# EAGLE design 5V_DCDC_XL7035 (EAGLE 9.6.1)
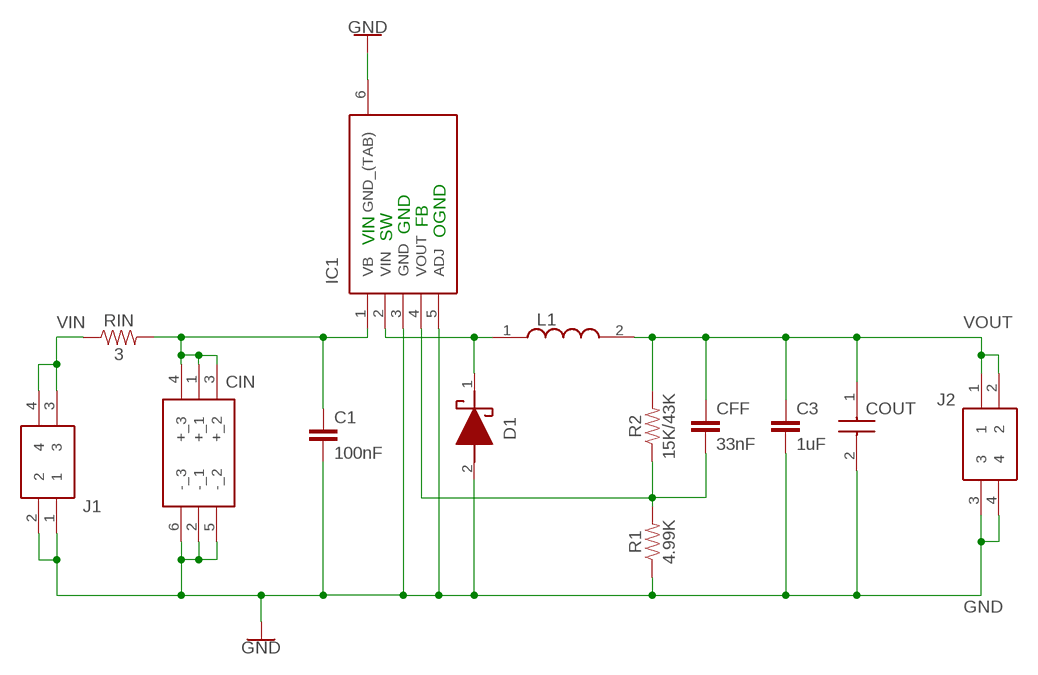
[diagram p0: schematic, sheet 1]

## Parts
C1  100nF  CAP-0603  [0603]
C3  1uF  CAP-0603  [0603]
CFF  33nF  CAP-0603  [0603]
CIN  EEE-FK1K101AV  [EEEFK0J332AV]
COUT  EMK325ABJ107MM-T  [CAPC3225X270N]
D1  S310  [DIONM8059X265N]
IC1  UC285TDKTTT-ADJ  [TO170P1524X483-6N]
J1  691411510002  [691411510002]
J2  691411510002  [691411510002]
L1  SRR1280-101M  [INDPM125125X800N]
R1  4.99K  RESISTOR0603  [0603]
R2  15K/43K  RESISTOR0603  [0603]
RIN  3  RESISTOR1206  [1206]

## Nets
GND: C1.2 C3.2 CIN.2(-_1) CIN.5(-_2) CIN.6(-_3) COUT.2 D1.2(A) IC1.3(GND) IC1.5(ADJ) IC1.6(GND_(TAB)) J1.1 J1.2 J2.3 J2.4 R1.1
N$1: C1.1 CIN.1(+_1) CIN.3(+_2) CIN.4(+_3) IC1.1(VB) RIN.2
N$2: D1.1(K) IC1.2(VIN) L1.1
N$4: CFF.2 IC1.4(VOUT) R1.2 R2.1
VIN: J1.3 J1.4 RIN.1
VOUT: C3.1 CFF.1 COUT.1 J2.1 J2.2 L1.2 R2.2

## Notes on the sheet
- FB
- GND | OGND
- VIN | SW

## Library data of the parts
C1 C3 CFF = SparkFun-Capacitors:CAP
CIN = EEE-FK1K101AV:EEE-FK1K101AV: Aluminum Electrolytic Capacitors - SMD 80VDC 100uF 20% Anti-Vibe AEC-Q200 Source: Datasheet <http://industrial.panasonic.com/cdbs/www-data/pdf/RDE0000/ABA0000C1178.pdf>; DESCRIPTION: Aluminum Electrolytic Capacitors - SMD 80VDC 100uF 20% Anti-Vibe AEC-Q200; HEIGHT: 14.3mm; MANUFACTURER_NAME: Panasonic; MANUFACTURER_PART_NUMBER: EEE-FK1K101AV; MOUSER_PART_NUMBER: 667-EEE-FK1K101AV; MOUSER_PRICE-STOCK: https://www.mouser.co.uk/ProductDetail/Panasonic/EEE-FK1K101AV?qs=%2FcpNaPGW7hhFXrootCr1oQ%3D%3D
COUT = EMK325ABJ107MM-T:EMK325ABJ107MM-T: TAIYO YUDEN - EMK325ABJ107MM-T - CAP, MLCC, X5R, 100UF, 16V, 1210 Source: Datasheet <https://componentsearchengine.com/Datasheets/2/EMK325ABJ107MM-T.pdf>; DESCRIPTION: TAIYO YUDEN - EMK325ABJ107MM-T - CAP, MLCC, X5R, 100UF, 16V, 1210; HEIGHT: 2.7mm; MANUFACTURER_NAME: TAIYO YUDEN; MANUFACTURER_PART_NUMBER: EMK325ABJ107MM-T; MOUSER_PART_NUMBER: 963-EMK325ABJ107MM-T; MOUSER_PRICE-STOCK: https://www.mouser.co.uk/ProductDetail/Taiyo-Yuden/EMK325ABJ107MM-T?qs=I6KAKw0tg2y0ShKbEoYruw%3D%3D
D1 = S310:S310: ON Semi 100V 3A, Schottky Diode, 2-Pin DO-214AB S310 Source: Datasheet <https://componentsearchengine.com/Datasheets/2/S310.pdf>; ARROW_PART_NUMBER: S310; ARROW_PRICE-STOCK: https://www.arrow.com/en/products/s310/on-semiconductor?region=nac; DESCRIPTION: ON Semi 100V 3A, Schottky Diode, 2-Pin DO-214AB S310; HEIGHT: 2.65mm; MANUFACTURER_NAME: ON Semiconductor; MANUFACTURER_PART_NUMBER: S310; MOUSER_PART_NUMBER: 512-S310; MOUSER_PRICE-STOCK: https://www.mouser.co.uk/ProductDetail/ON-Semiconductor-Fairchild/S310?qs=AZz8fAaf6P%2FJSlbiibJLxA%3D%3D
IC1 = UC285TDKTTT-ADJ:UC285TDKTTT-ADJ: UC285TDKTTT-ADJ, Low Dropout Voltage Regulator, Adj./Fixed 5A, 1.2 V, 6 V, 6-Pin TO-263 Source: Datasheet <https://datasheet.datasheetarchive.com/originals/distributors/SFDatasheet-7/sf-000145420.pdf>; DESCRIPTION: UC285TDKTTT-ADJ, Low Dropout Voltage Regulator, Adj./Fixed 5A, 1.2 V, 6 V, 6-Pin TO-263; HEIGHT: 5.13mm; MANUFACTURER_NAME: Texas Instruments; MANUFACTURER_PART_NUMBER: UC285TDKTTT-ADJ; MOUSER_PART_NUMBER: 595-UC285TDKTTT-ADJ; MOUSER_PRICE-STOCK: https://www.mouser.com/Search/Refine.aspx?Keyword=595-UC285TDKTTT-ADJ
J1 J2 = 691411510002:691411510002: Fixed Terminal Blocks WR-TBL 5.08mm 2Pin 10A 250V 20mOhm Source: Datasheet <https://www.we-online.com/catalog/datasheet/691411510002.pdf>; DESCRIPTION: Fixed Terminal Blocks WR-TBL 5.08mm 2Pin 10A 250V 20mOhm; HEIGHT: 14mm; MANUFACTURER_NAME: Wurth Elektronik; MANUFACTURER_PART_NUMBER: 691411510002; MOUSER_PART_NUMBER: 710-691411510002; MOUSER_PRICE-STOCK: https://www.mouser.co.uk/ProductDetail/Wurth-Elektronik/691411510002?qs=sPbYRqrBIVncFMjj2IW62A%3D%3D
L1 = SRR1280-101M:SRR1280-101M: Power inductor SMD shielded 100uH Bourns SRR1280 Series Shielded Wire-wound SMD Inductor with a Ferrite Core, 100 uH +/-20% 2.1A Idc Q:18 Source: Datasheet <https://componentsearchengine.com/Datasheets/2/SRR1280-101M.pdf>; ARROW_PART_NUMBER: SRR1280-101M; ARROW_PRICE-STOCK: https://www.arrow.com/en/products/srr1280-101m/bourns; DESCRIPTION: Power inductor SMD shielded 100uH Bourns SRR1280 Series Shielded Wire-wound SMD Inductor with a Ferrite Core, 100 uH +/-20% 2.1A Idc Q:18; HEIGHT: 8mm; MANUFACTURER_NAME: Bourns; MANUFACTURER_PART_NUMBER: SRR1280-101M; MOUSER_PART_NUMBER: 652-SRR1280-101M; MOUSER_PRICE-STOCK: https://www.mouser.co.uk/ProductDetail/Bourns/SRR1280-101M?qs=brMhP%2FMjUfd8D85Ep5aW7g%3D%3D
R1 R2 RIN = SparkFun-Resistors:RESISTOR: Generic Resistor Package

## Board
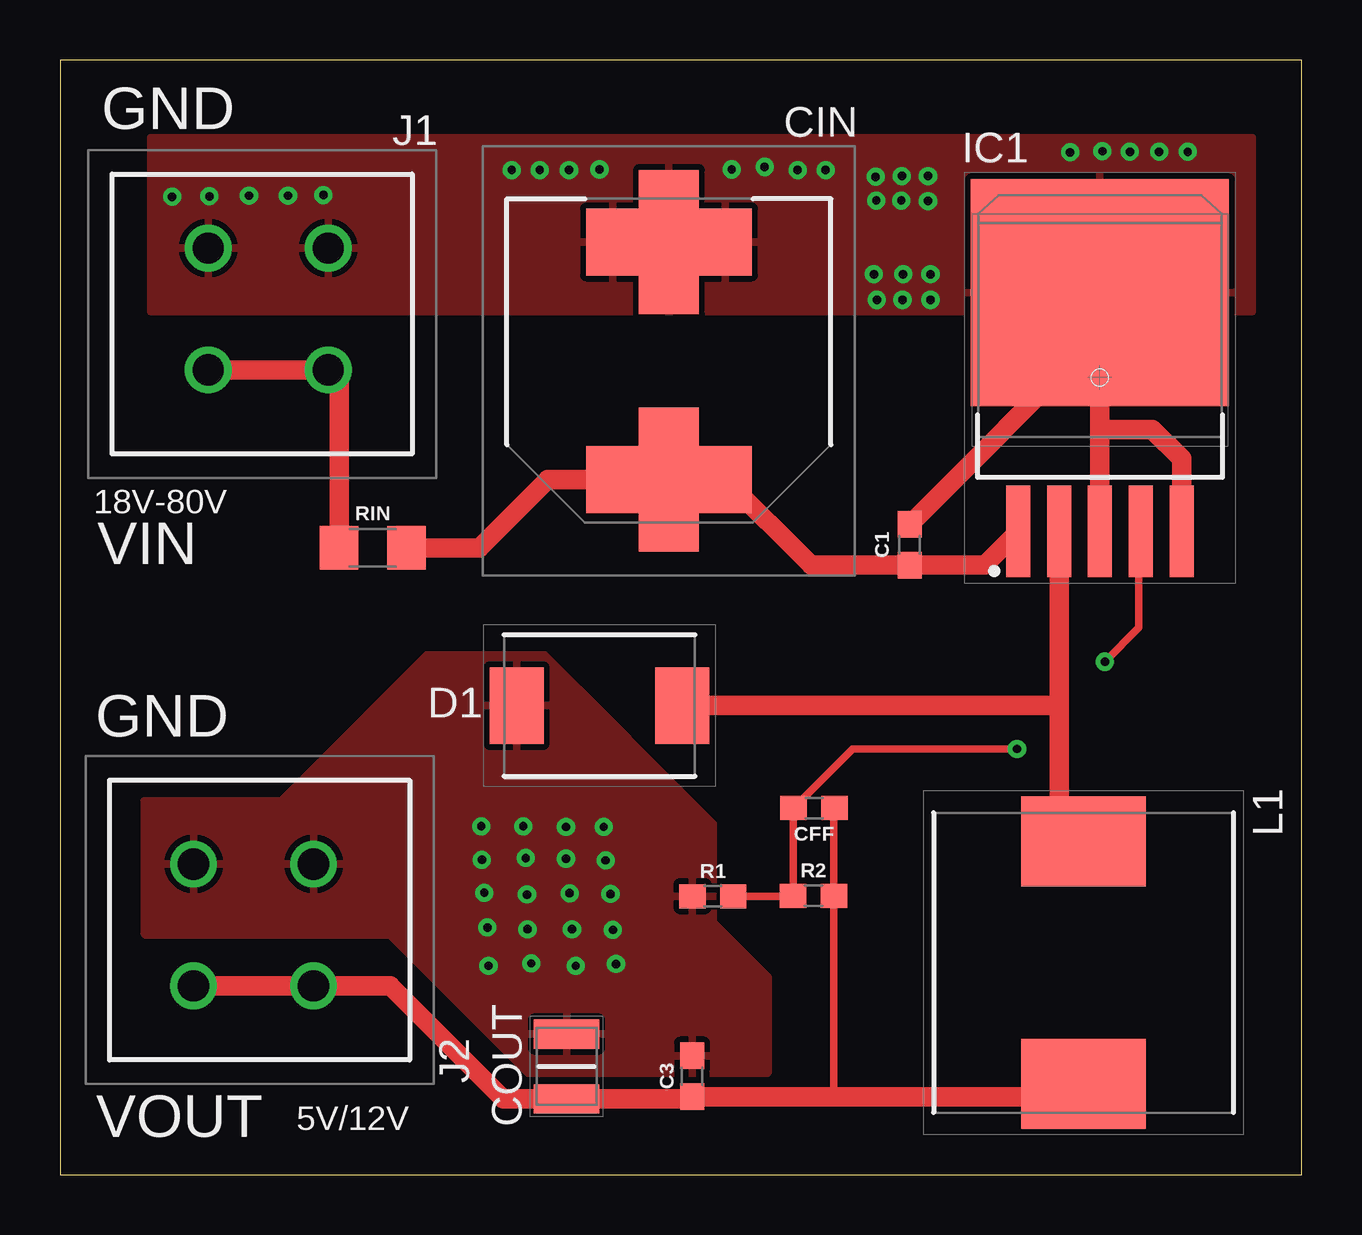
[diagram p1: board, top side]
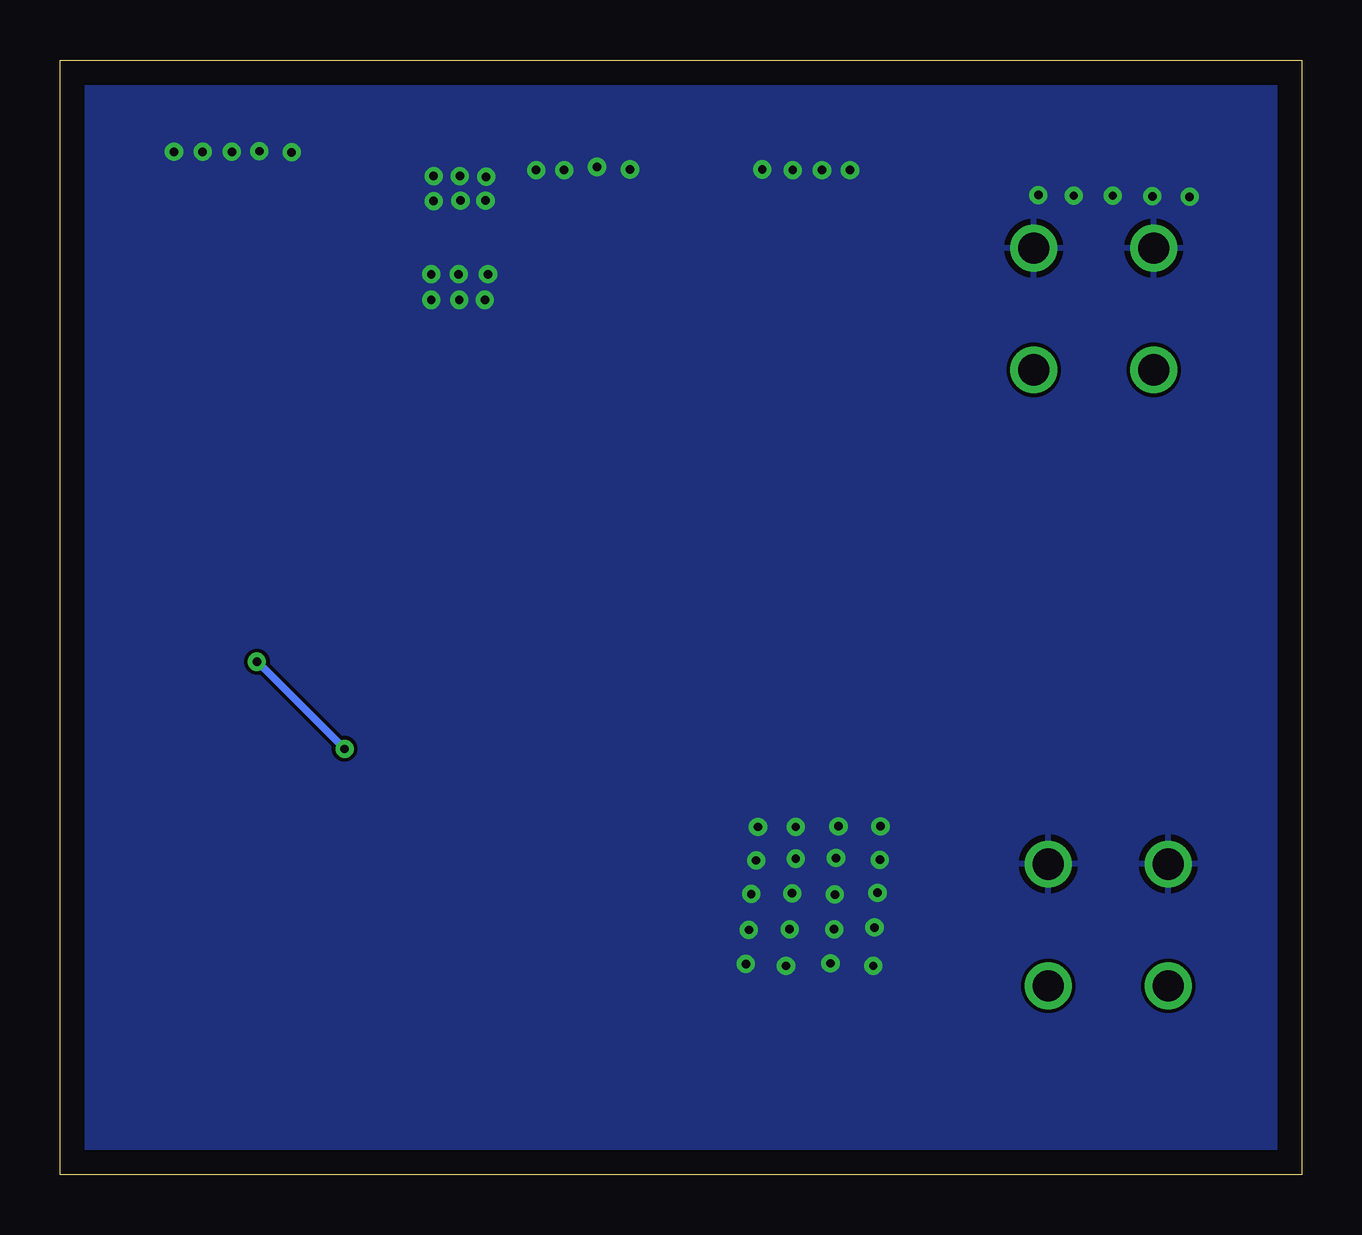
[diagram p2: board, bottom side, seen from below]

Size 51.74 x 46.47 mm. Coordinates in mm from the lower left corner, seen from the top.
Outline: 0,0 51.74,0 51.74,46.47 0,46.47 0,0
Copper layers (1*16): Top 0.035mm / dielectric 1.5mm / Bottom 0.035mm
Design rules "default": minimum track width 6mil, minimum drill 0.35mm, track to track 6mil, track to pad 6mil, pad to pad 6mil, via to via 6mil, smd to smd 6mil, copper to edge 40mil, drill to drill 6mil, minimum pad ring 10mil, minimum via ring 8mil, stop-mask expansion 4mil, vias tented up to drill 0mil, thermal gap 10mil

### Footprints (pad centres in the part's own frame; a part is rotated, then mirrored left to right if it is on the bottom)
0603 = smd 1.1 x 1: 1 -0.85,0; 2 0.85,0
EEEFK0J332AV = smd 2.5 x 6: 1 0,-4.95; 2 0,4.95 | smd 2.2 x 2.8: 3 -2.35,-4.95; 4 2.35,-4.95; 5 -2.35,4.95; 6 2.35,4.95
CAPC3225X270N = smd 1.22 x 2.72: 1 -1.35,0; 2 1.35,0
DIONM8059X265N = smd 2.25 x 3.2: 1 -3.45,0; 2 3.45,0
TO170P1524X483-6N = smd 3.8 x 1: 1 -6.4,3.4; 2 -6.4,1.7; 3 -6.4,0; 4 -6.4,-1.7; 5 -6.4,-3.4 | smd 9.45 x 10.75: 6 3.55,0
691411510002 = drill 1.3 pad 1.95: 1 0,0; 2 0,5; 3 5.08,0; 4 5.08,5
INDPM125125X800N = smd 3.75 x 5.2: 1 -5.05,0; 2 5.05,0
1206 = smd 1.6 x 1.8: 1 -1.4,0; 2 1.4,0

### Placement (x,y rotation side)
C1  35.41,26.26 90 top
C3  26.34,4.11 90 top
CFF  31.42,15.29 180 top
CIN  25.37,33.93 0 top
COUT  21.11,4.52 90 top
D1  22.48,19.56 180 top
IC1  43.33,33.22 90 top
J1  6.17,38.63 270 top
J2  10.57,7.87 90 top
L1  42.65,8.84 270 top
R1  27.2,11.61 0 top
R2  31.39,11.63 0 top
RIN  13.03,26.14 0 top

### Tracks (layer width: path | path; a pad name or v marks a point on that pad's centre or on a via)
GND  (via drill 0.35)
  Top 0.813: CIN.5 CIN.2 | C1.2 43.33,35.04 IC1.6 43.33,31.06 | 43.33,31.06 IC1.3 | IC1.5 46.73,29.85 45.52,31.06 43.33,31.06
  other vias: 33.99,41.61 35.08,41.63 36.17,41.63 34.01,40.61 35.05,40.61 36.17,40.59 42.09,42.62 43.43,42.67 44.58,42.65 45.8,42.65 46.99,42.65 18.82,41.88 19.99,41.88 21.21,41.88 22.48,41.91 27.99,41.91 29.36,42.01 30.73,41.88 31.9,41.88 33.91,37.54 35.13,37.54 36.27,37.54 36.27,36.47 35.1,36.47 34.04,36.47 4.67,40.77 6.22,40.79 7.87,40.82 9.5,40.82 10.97,40.84 17.55,14.53 19.3,14.53 21.08,14.5 22.66,14.5 17.58,13.13 19.41,13.21 21.08,13.18 22.73,13.11 17.68,11.76 19.46,11.68 21.23,11.73 22.94,11.71 17.81,10.31 19.48,10.24 21.34,10.24 23.04,10.21 17.86,8.71 19.63,8.81 21.49,8.71 23.16,8.79
  pour Bottom: 0.48,45.95 0.48,0.56 51.21,0.56 51.21,45.95
  pour Top: 3.78,43.23 3.78,35.99 49.68,35.99 49.68,43.23
  pour Top: 3.51,15.6 3.51,10.06 3.56,10.01 13.74,10.01 19.51,4.24 29.46,4.24 29.51,4.29 29.51,8.23 27.3,10.44 27.23,10.52 27.23,14.4 27.23,14.63 20.19,21.67 15.29,21.67 10.26,16.64 9.22,15.6
N$1
  Top 0.813: RIN.2 17.48,26.14 20.32,28.98 CIN.3 CIN.1 CIN.4 31.3,25.41 C1.1 38.52,25.41 IC1.1
N$2
  Top 0.813: IC1.2 41.63,19.56 | 41.63,19.56 41.63,14.9 L1.1 | D1.1 41.63,19.56
N$4  (via drill 0.35)
  Top 0.305: R1.2 30.52,11.61 R2.1 30.54,15.27 CFF.2 33.03,17.75 v39.88,17.75 | v43.54,21.39 44.96,22.81 44.96,26.75 IC1.4
  Bottom 0.305: v39.88,17.75 43.51,21.39 v43.54,21.39
VIN
  Top 0.813: J1.3 J1.4 11.63,33.09 RIN.1
VOUT
  Top 0.305: 32.26,3.25 32.24,3.26 R2.2 32.24,15.27 CFF.1
  Top 0.813: L1.2 42.1,3.25 32.26,3.25 26.36,3.25 C3.1 26.25,3.17 COUT.1 18.47,3.17 13.77,7.87 J2.1 J2.2

### Text on the board
tPlace: GND | 18V-80V | VIN | GND | VOUT | 5V/12V